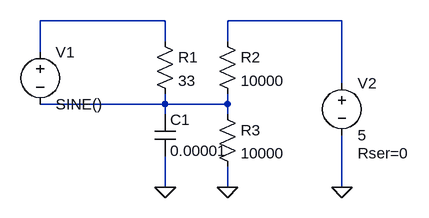
[diagram p0: schematic ESP32QuadCT.asc]
ESP32QuadCT.asc, the LTspice schematic file:
Version 4
SHEET 1 880 680
WIRE -32 -128 -224 -128
WIRE 240 -128 64 -128
WIRE -32 -96 -32 -128
WIRE 64 -96 64 -128
WIRE -224 -80 -224 -128
WIRE 240 -32 240 -128
WIRE -32 0 -32 -16
WIRE -32 0 -224 0
WIRE 64 0 64 -16
WIRE 64 0 -32 0
WIRE -32 16 -32 0
WIRE 64 16 64 0
WIRE -32 128 -32 80
WIRE 64 128 64 96
WIRE 240 128 240 48
FLAG -32 128 0
FLAG 64 128 0
FLAG 240 128 0
SYMBOL cap -48 16 R0
SYMATTR InstName C1
SYMATTR Value 0.00001
SYMBOL res -48 -112 R0
SYMATTR InstName R1
SYMATTR Value 33
SYMBOL res 48 -112 R0
SYMATTR InstName R2
SYMATTR Value 10000
SYMBOL res 48 0 R0
SYMATTR InstName R3
SYMATTR Value 10000
SYMBOL voltage -224 -96 R0
WINDOW 123 0 0 Left 0
WINDOW 39 0 0 Left 0
SYMATTR InstName V1
SYMATTR Value SINE()
SYMBOL voltage 240 -48 R0
WINDOW 123 0 0 Left 0
WINDOW 39 24 124 Left 2
SYMATTR InstName V2
SYMATTR Value 5
SYMATTR SpiceLine Rser=0

The netlist it stands for:
* ESP32QuadCT.asc
C1 N003 0 0.00001
R1 N001 N003 33
R2 N002 N003 10000
R3 N003 0 10000
V1 N001 N003 SINE()
V2 N002 0 5 Rser=0
.backanno
.end